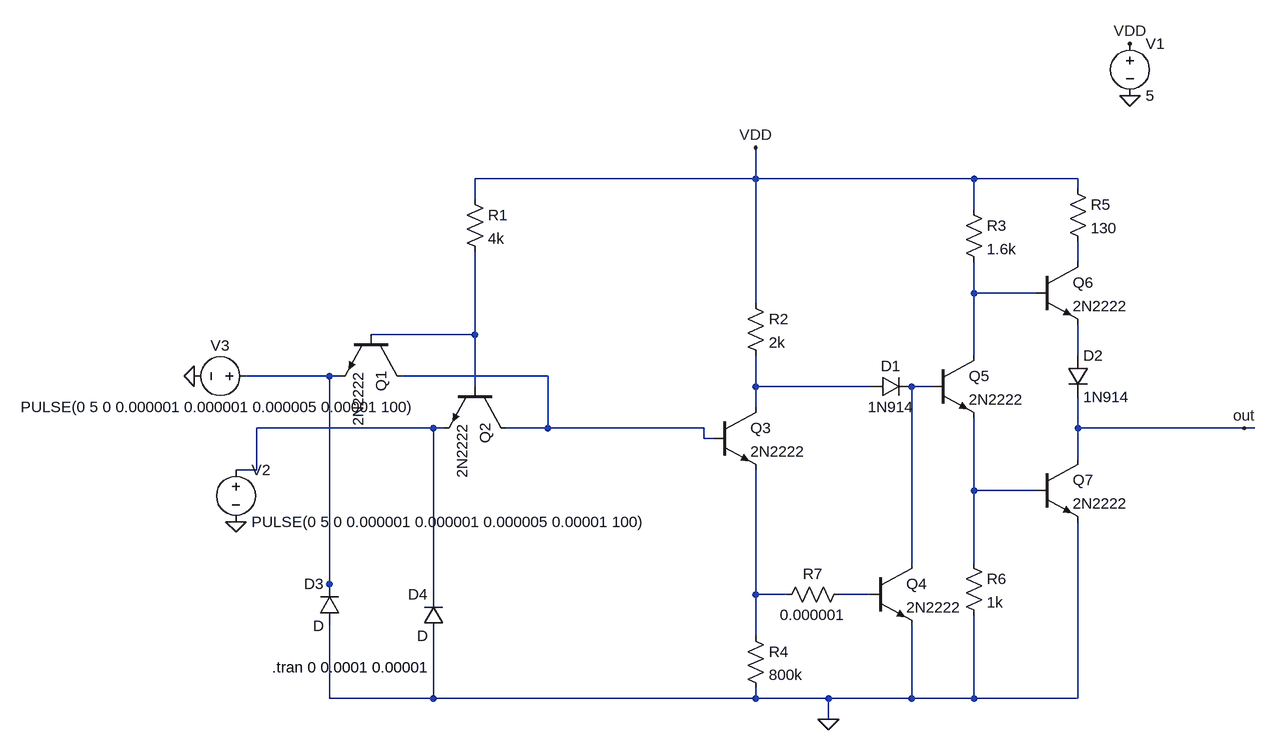
[diagram p0: schematic and_intento.asc]
and_intento.asc, the LTspice schematic file:
Version 4
SHEET 1 1872 724
WIRE 656 -128 656 -176
WIRE 656 -128 224 -128
WIRE 992 -128 656 -128
WIRE 1152 -128 992 -128
WIRE 1152 -112 1152 -128
WIRE 224 -96 224 -128
WIRE 992 -80 992 -128
WIRE 1152 0 1152 -32
WIRE 992 48 992 0
WIRE 1088 48 992 48
WIRE 656 64 656 -128
WIRE 224 112 224 -16
WIRE 224 112 64 112
WIRE 992 144 992 48
WIRE 1152 144 1152 96
WIRE 0 176 -128 176
WIRE 16 176 0 176
WIRE 336 176 112 176
WIRE 224 192 224 112
WIRE 656 192 656 144
WIRE 832 192 656 192
WIRE 928 192 896 192
WIRE 656 224 656 192
WIRE 160 256 -112 256
WIRE 176 256 160 256
WIRE 336 256 336 176
WIRE 336 256 272 256
WIRE 576 256 336 256
WIRE 1152 256 1152 208
WIRE 1408 256 1152 256
WIRE 1424 256 1408 256
WIRE 576 272 576 256
WIRE 592 272 576 272
WIRE 1152 304 1152 256
WIRE -112 320 -112 256
WIRE -112 320 -144 320
WIRE 992 352 992 240
WIRE 1088 352 992 352
WIRE 896 464 896 192
WIRE 992 464 992 352
WIRE 0 496 0 176
WIRE 0 512 0 496
WIRE 160 512 160 256
WIRE 656 512 656 320
WIRE 704 512 656 512
WIRE 832 512 784 512
WIRE 656 576 656 512
WIRE 0 672 0 560
WIRE 160 672 160 576
WIRE 160 672 0 672
WIRE 656 672 656 656
WIRE 656 672 160 672
WIRE 768 672 656 672
WIRE 896 672 896 560
WIRE 896 672 768 672
WIRE 992 672 992 544
WIRE 992 672 896 672
WIRE 1152 672 1152 400
WIRE 1152 672 992 672
WIRE 768 704 768 672
FLAG 768 704 0
FLAG 656 -176 VDD
FLAG -208 176 0
FLAG -144 400 0
FLAG 1232 -256 0
FLAG 1232 -336 VDD
FLAG 1408 256 out
SYMBOL npn 112 112 R90
SYMATTR InstName Q1
SYMATTR Value 2N2222
SYMBOL npn 272 192 R90
SYMATTR InstName Q2
SYMATTR Value 2N2222
SYMBOL res 208 -112 R0
SYMATTR InstName R1
SYMATTR Value 4k
SYMBOL npn 592 224 R0
SYMATTR InstName Q3
SYMATTR Value 2N2222
SYMBOL res 640 48 R0
SYMATTR InstName R2
SYMATTR Value 2k
SYMBOL res 640 560 R0
SYMATTR InstName R4
SYMATTR Value 800k
SYMBOL voltage 1232 -352 R0
WINDOW 123 0 0 Left 0
WINDOW 39 0 0 Left 0
SYMATTR InstName V1
SYMATTR Value 5
SYMBOL voltage -144 304 R0
WINDOW 123 0 0 Left 0
WINDOW 39 0 0 Left 0
SYMATTR InstName V2
SYMATTR Value PULSE(0 5 0 0.000001 0.000001 0.000005 0.00001 100)
SYMBOL voltage -112 176 R90
WINDOW 0 -32 56 VBottom 2
WINDOW 3 32 56 VTop 2
WINDOW 123 0 0 Left 0
WINDOW 39 0 0 Left 0
SYMATTR InstName V3
SYMATTR Value PULSE(0 5 0 0.000001 0.000001 0.000005 0.00001 100)
SYMBOL diode 832 208 R270
WINDOW 0 32 32 VTop 2
WINDOW 3 0 32 VBottom 2
SYMATTR InstName D1
SYMATTR Value 1N914
SYMBOL npn 832 464 R0
SYMATTR InstName Q4
SYMATTR Value 2N2222
SYMBOL npn 928 144 R0
SYMATTR InstName Q5
SYMATTR Value 2N2222
SYMBOL npn 1088 0 R0
SYMATTR InstName Q6
SYMATTR Value 2N2222
SYMBOL res 976 -96 R0
SYMATTR InstName R3
SYMATTR Value 1.6k
SYMBOL res 1136 -128 R0
SYMATTR InstName R5
SYMATTR Value 130
SYMBOL diode 1136 144 R0
SYMATTR InstName D2
SYMATTR Value 1N914
SYMBOL npn 1088 304 R0
SYMATTR InstName Q7
SYMATTR Value 2N2222
SYMBOL res 976 448 R0
SYMATTR InstName R6
SYMATTR Value 1k
SYMBOL diode 16 560 R180
WINDOW 0 24 64 Left 2
WINDOW 3 24 0 Left 2
SYMATTR InstName D3
SYMBOL diode 176 576 R180
WINDOW 0 24 64 Left 2
WINDOW 3 24 0 Left 2
SYMATTR InstName D4
SYMBOL res 800 496 R90
WINDOW 0 0 56 VBottom 2
WINDOW 3 32 56 VTop 2
SYMATTR InstName R7
SYMATTR Value 0.000001
TEXT -88 624 Left 2 !.tran 0 0.0001 0.00001

The netlist it stands for:
* and_intento.asc
Q1 N006 N003 N005 0 2N2222
Q2 N006 N003 N009 0 2N2222
R1 VDD N003 4k
Q3 N007 N006 N011 0 2N2222
R2 VDD N007 2k
R4 N011 0 800k
V1 VDD 0 5
V2 N009 0 PULSE(0 5 0 0.000001 0.000001 0.000005 0.00001 100)
V3 N005 0 PULSE(0 5 0 0.000001 0.000001 0.000005 0.00001 100)
D1 N007 N008 1N914
Q4 N008 N012 0 0 2N2222
Q5 N002 N008 N010 0 2N2222
Q6 N001 N002 N004 0 2N2222
R3 VDD N002 1.6k
R5 VDD N001 130
D2 N004 out 1N914
Q7 out N010 0 0 2N2222
R6 N010 0 1k
D3 0 N005 D
D4 0 N009 D
R7 N012 N011 0.000001
.model D D
.lib standard.dio
.model NPN NPN
.model PNP PNP
.lib standard.bjt
.tran 0 0.0001 0.00001
.backanno
.end